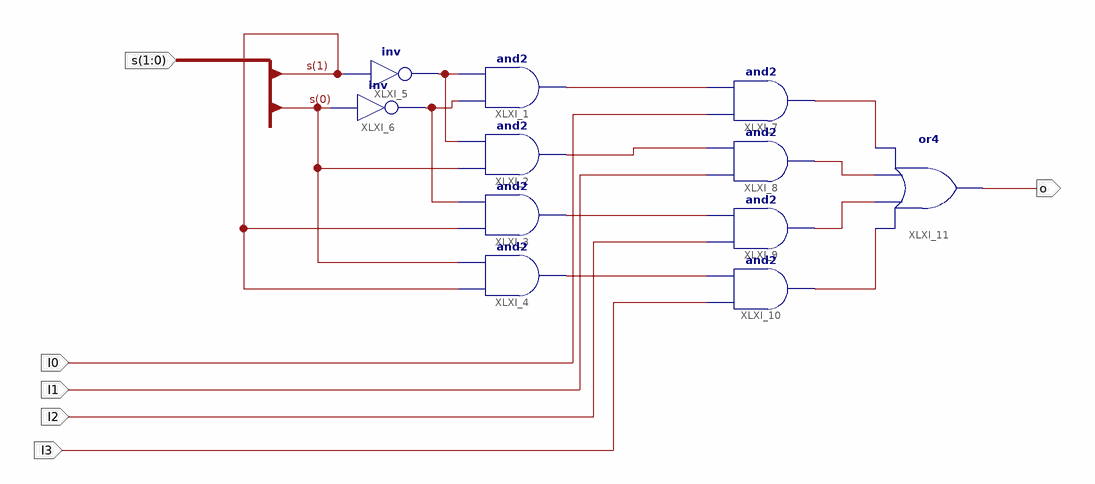
[diagram p0: schematic sheet 1]
// Xilinx ISE schematic Mux4to1.sch (kintex7) as structural Verilog: 11 symbols, 6 ports
module Mux4to1 (
  input  [1:0] s,
  input  I0,
  input  I1,
  input  I2,
  input  I3,
  output o
);

  wire ns0, ns1, XLXN_6, XLXN_7, XLXN_8, XLXN_9, XLXN_10, XLXN_11, XLXN_12, XLXN_13;

  and XLXI_1 (XLXN_6, ns0, ns1);
  and XLXI_2 (XLXN_7, s[0], ns1);
  and XLXI_3 (XLXN_8, s[1], ns0);
  and XLXI_4 (XLXN_9, s[1], s[0]);
  not XLXI_5 (ns1, s[1]);
  not XLXI_6 (ns0, s[0]);
  and XLXI_7 (XLXN_10, I0, XLXN_6);
  and XLXI_8 (XLXN_11, I1, XLXN_7);
  and XLXI_9 (XLXN_12, I2, XLXN_8);
  and XLXI_10 (XLXN_13, I3, XLXN_9);
  or XLXI_11 (o, XLXN_13, XLXN_12, XLXN_11, XLXN_10);
endmodule
